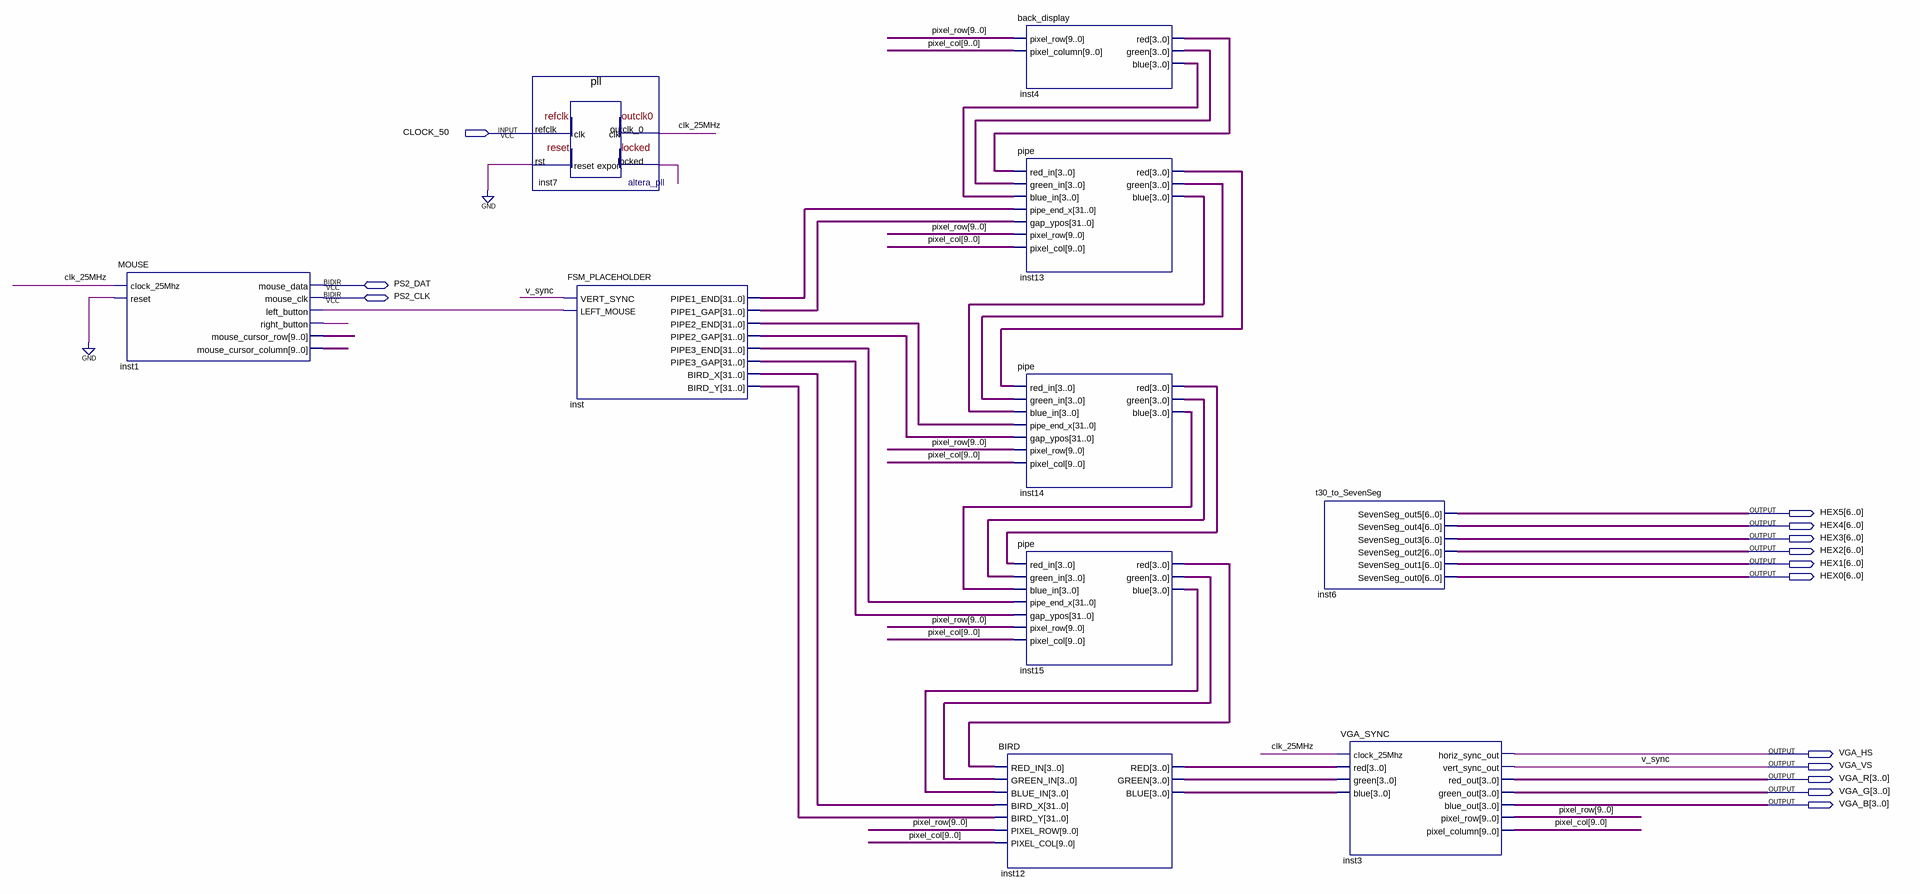
[diagram p0: schematic sheet]
// Quartus schematic flappy-bird.bdf as structural Verilog: 10 symbols, 14 pins
module \flappy-bird  (
  input  CLOCK_50,
  inout  PS2_DAT,
  inout  PS2_CLK,
  output [6:0] HEX5,
  output [6:0] HEX4,
  output [6:0] HEX3,
  output [6:0] HEX2,
  output [6:0] HEX1,
  output [6:0] HEX0,
  output VGA_HS,
  output VGA_VS,
  output [3:0] VGA_R,
  output [3:0] VGA_G,
  output [3:0] VGA_B
);

  wire clk_25MHz, inst1_left_button, inst1_right_button, inst7_locked;
  wire [3:0] inst4_blue, inst4_green, inst4_red, inst12_blue, inst12_green, inst12_red, inst13_blue,
       inst13_green, inst13_red, inst14_blue, inst14_green, inst14_red, inst15_blue, inst15_green, inst15_red;
  wire [9:0] inst1_mouse_cursor_column, inst1_mouse_cursor_row, pixel_col, pixel_row;
  wire [31:0] inst_bird_x, inst_bird_y, inst_pipe1_end, inst_pipe1_gap, inst_pipe2_end, inst_pipe2_gap,
       inst_pipe3_end, inst_pipe3_gap;

  MOUSE inst1 (
    .clock_25Mhz(clk_25MHz), .reset(1'b0), .left_button(inst1_left_button),
    .right_button(inst1_right_button), .mouse_cursor_row(inst1_mouse_cursor_row),
    .mouse_cursor_column(inst1_mouse_cursor_column), .mouse_data(PS2_DAT), .mouse_clk(PS2_CLK));
  pll inst7 (.refclk(CLOCK_50), .rst(1'b0), .outclk_0(clk_25MHz), .locked(inst7_locked));
  FSM_PLACEHOLDER inst (
    .VERT_SYNC(VGA_VS), .LEFT_MOUSE(inst1_left_button), .PIPE1_END(inst_pipe1_end),
    .PIPE1_GAP(inst_pipe1_gap), .PIPE2_END(inst_pipe2_end), .PIPE2_GAP(inst_pipe2_gap),
    .PIPE3_END(inst_pipe3_end), .PIPE3_GAP(inst_pipe3_gap), .BIRD_X(inst_bird_x), .BIRD_Y(inst_bird_y));
  BIRD inst12 (
    .RED_IN(inst15_red), .GREEN_IN(inst15_green), .BLUE_IN(inst15_blue), .BIRD_X(inst_bird_x),
    .BIRD_Y(inst_bird_y), .PIXEL_ROW(pixel_row), .PIXEL_COL(pixel_col), .RED(inst12_red),
    .GREEN(inst12_green), .BLUE(inst12_blue));
  back_display inst4 (
    .pixel_row(pixel_row), .pixel_column(pixel_col), .red(inst4_red), .green(inst4_green), .blue(inst4_blue));
  pipe inst13 (
    .red_in(inst4_red), .green_in(inst4_green), .blue_in(inst4_blue), .pipe_end_x(inst_pipe1_end),
    .gap_ypos(inst_pipe1_gap), .pixel_row(pixel_row), .pixel_col(pixel_col), .red(inst13_red),
    .green(inst13_green), .blue(inst13_blue));
  pipe inst14 (
    .red_in(inst13_red), .green_in(inst13_green), .blue_in(inst13_blue), .pipe_end_x(inst_pipe2_end),
    .gap_ypos(inst_pipe2_gap), .pixel_row(pixel_row), .pixel_col(pixel_col), .red(inst14_red),
    .green(inst14_green), .blue(inst14_blue));
  pipe inst15 (
    .red_in(inst14_red), .green_in(inst14_green), .blue_in(inst14_blue), .pipe_end_x(inst_pipe3_end),
    .gap_ypos(inst_pipe3_gap), .pixel_row(pixel_row), .pixel_col(pixel_col), .red(inst15_red),
    .green(inst15_green), .blue(inst15_blue));
  t30_to_SevenSeg inst6 (
    .SevenSeg_out5(HEX5), .SevenSeg_out4(HEX4), .SevenSeg_out3(HEX3), .SevenSeg_out2(HEX2),
    .SevenSeg_out1(HEX1), .SevenSeg_out0(HEX0));
  VGA_SYNC inst3 (
    .clock_25Mhz(clk_25MHz), .red(inst12_red), .green(inst12_green), .blue(inst12_blue),
    .horiz_sync_out(VGA_HS), .vert_sync_out(VGA_VS), .red_out(VGA_R), .green_out(VGA_G), .blue_out(VGA_B),
    .pixel_row(pixel_row), .pixel_column(pixel_col));

  // Other names for the same wires on the sheet: v_sync = VGA_VS
endmodule
